# Altium schematic sheet принципиальная.schdoc
size 840 x 594 mm; Address1: Address1; Address2: Address2; Address3: Address3; Разраб.: Каленик; Обозначение документа: ГУИР.467849.001 Э3; Пров.: Порхун; Т.контр.: Порхун; Н.контр.: Лихачев; Утв.: Азаров; Общее количество листов: 1; Литера: Т; Наименование организации: БГУИР, гр. 850701; Наименование изделия 1: Электронная книга на; Нач. отд.: Реценз.; Rule: PcbType=ProtelPcb
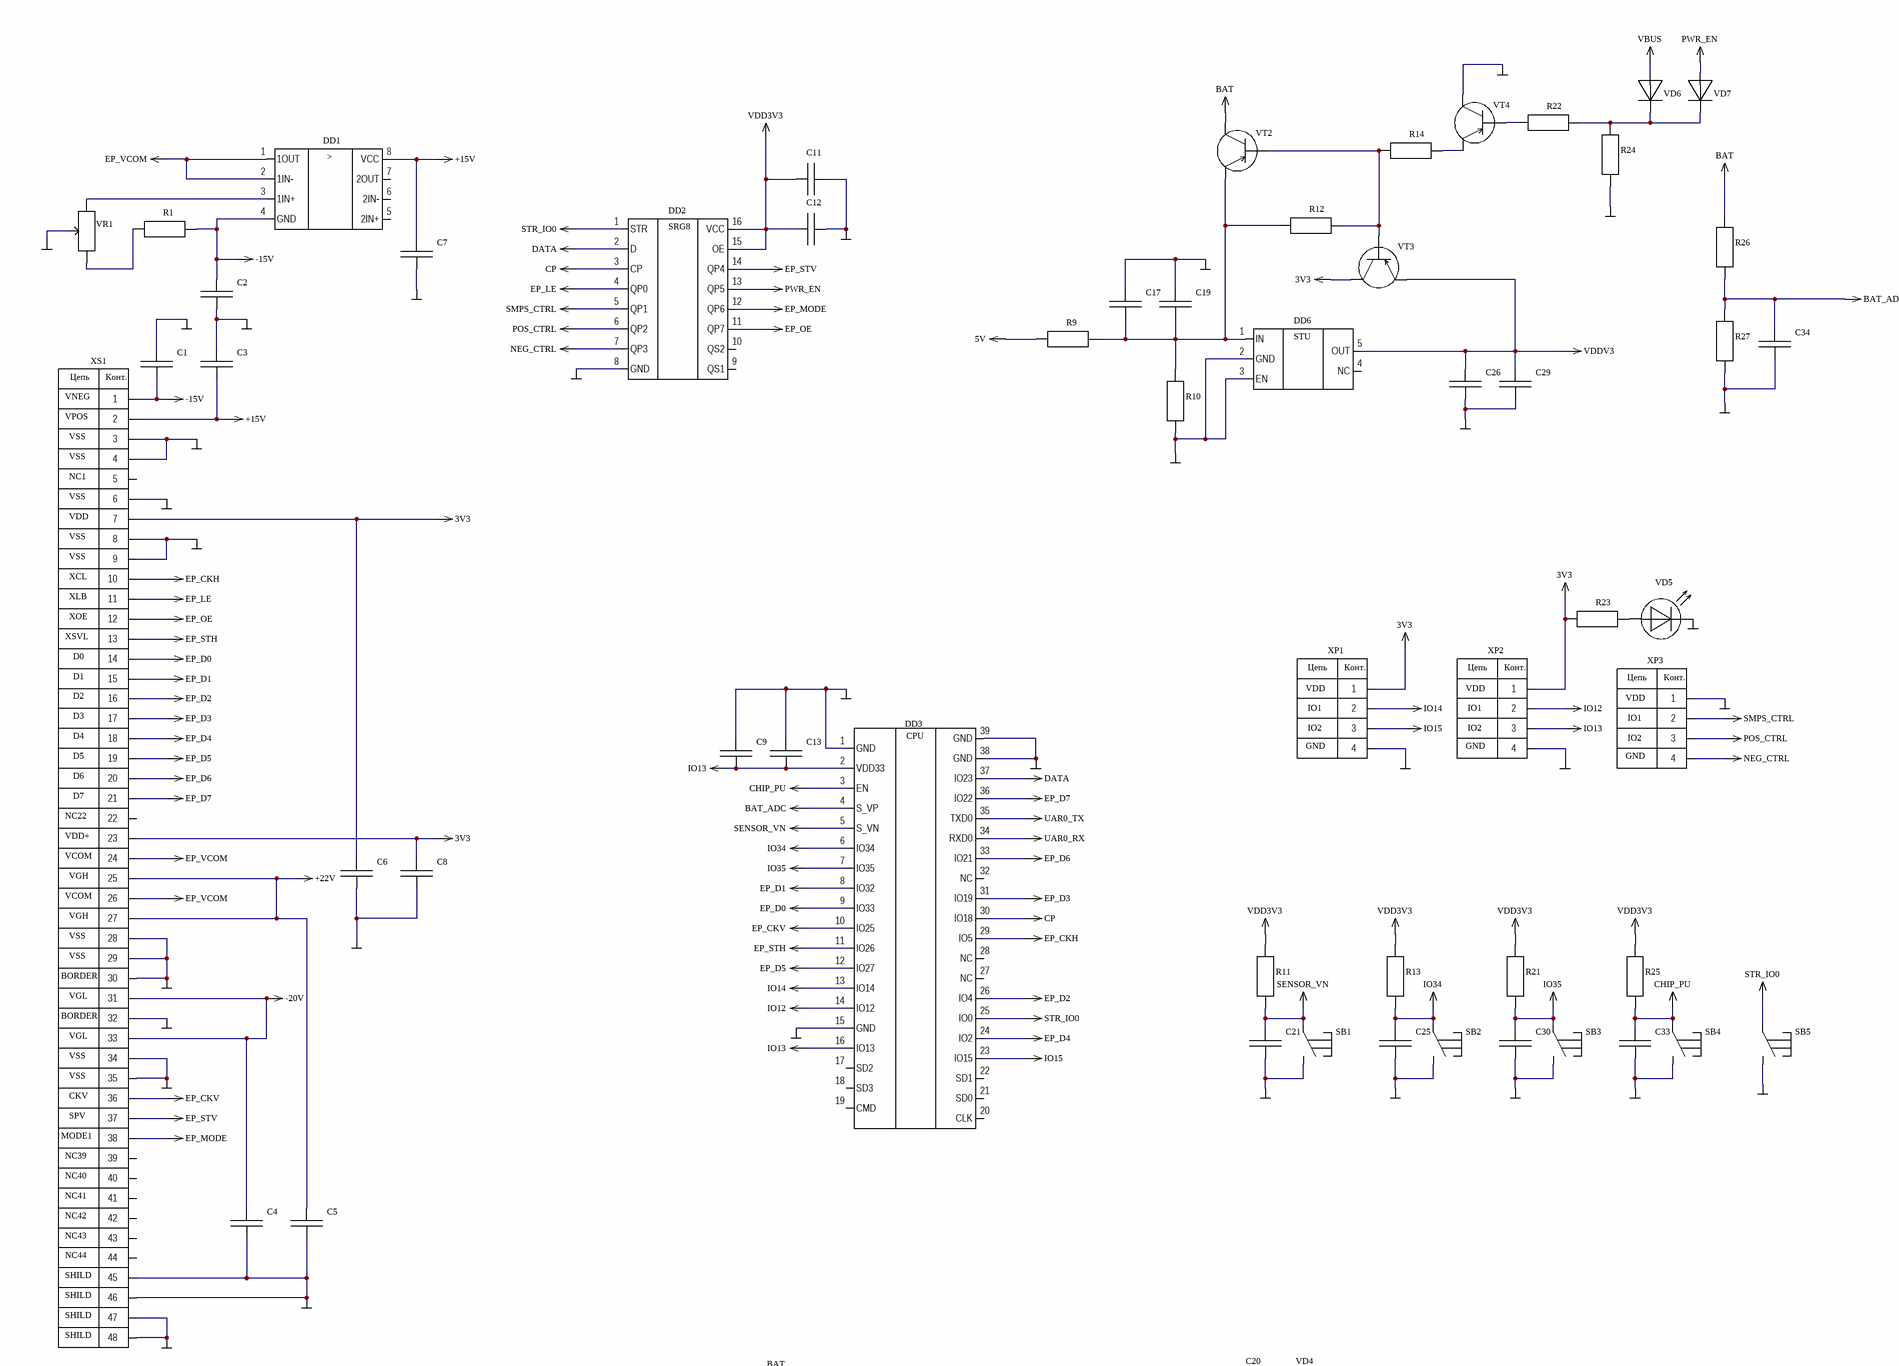
[diagram p0: принципиальная.schdoc, top left]
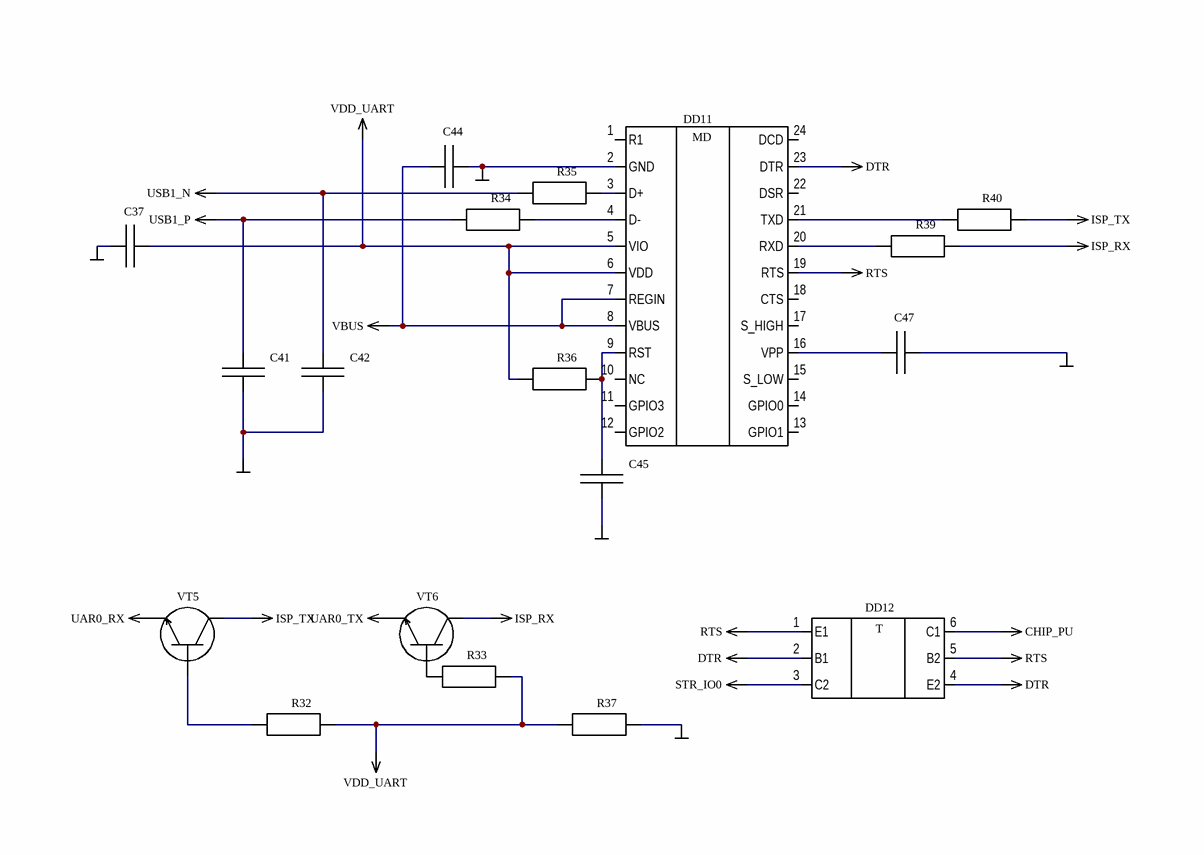
[diagram p1: принципиальная.schdoc, top right]
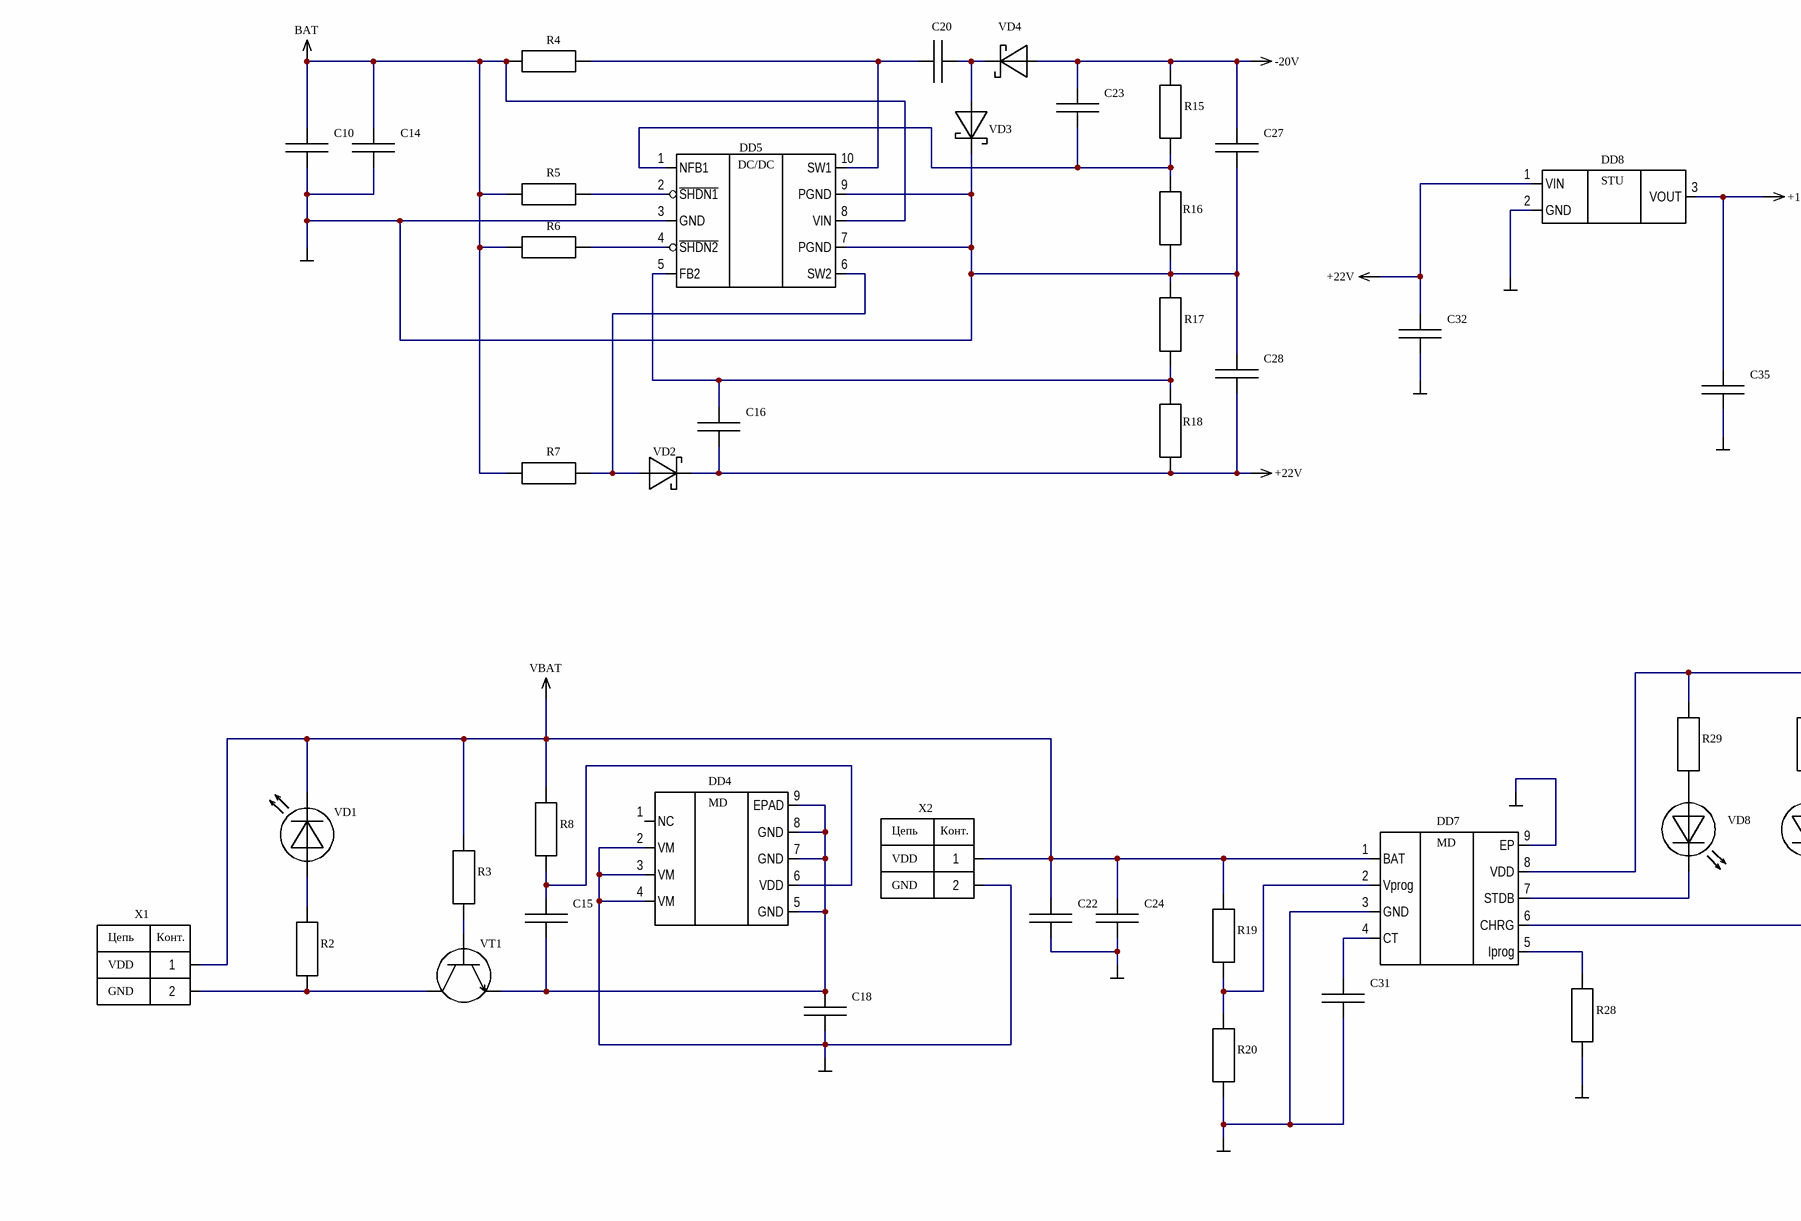
[diagram p2: принципиальная.schdoc, bottom left]
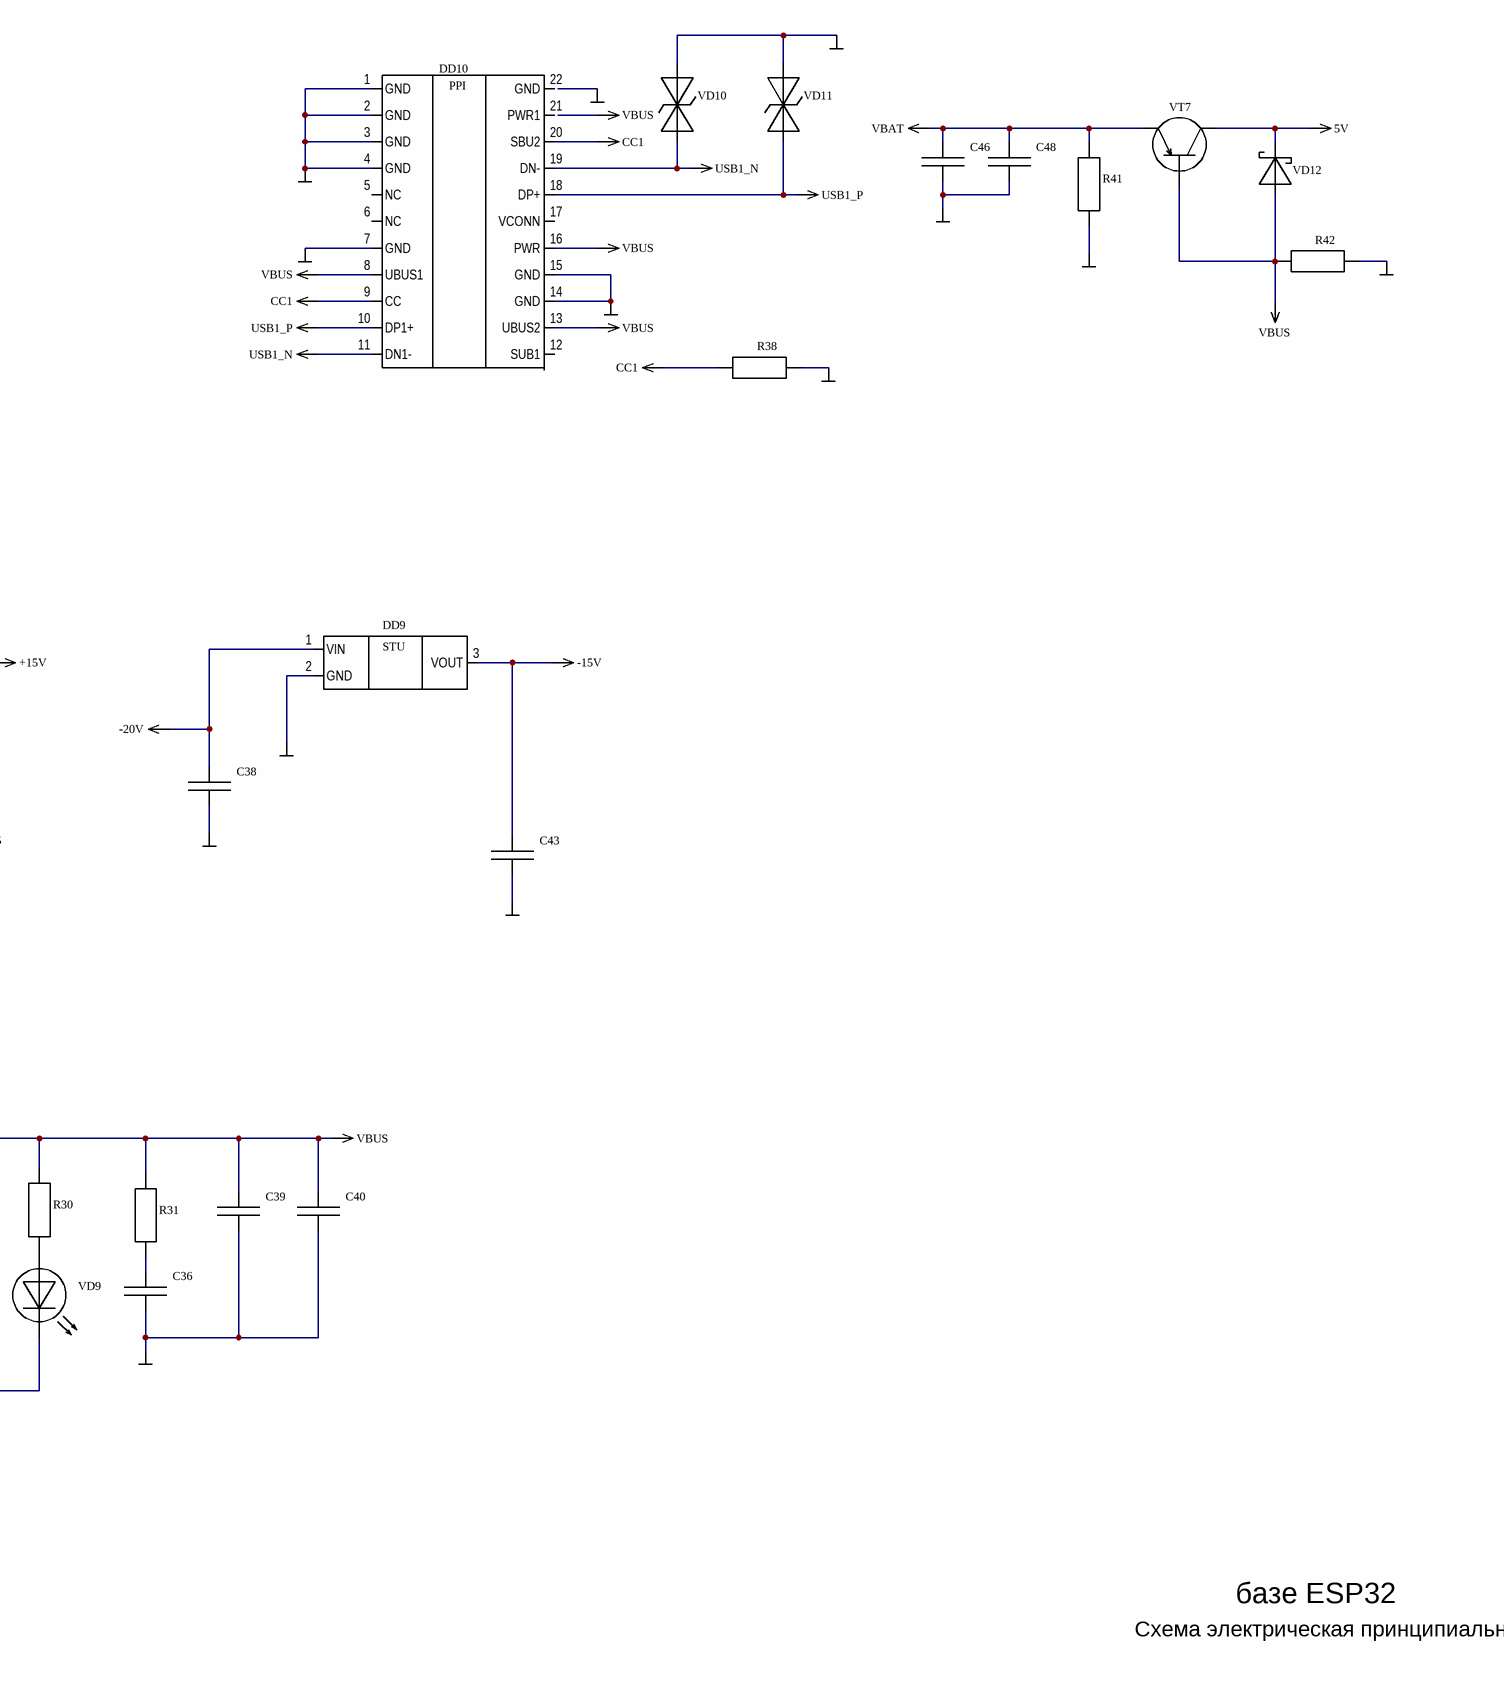
[diagram p3: принципиальная.schdoc, bottom right]

## Parts
C1  Capacitor  [CAP3216X125N]  (value not drawn)
C2  Capacitor  [CAP3216X125N]  (value not drawn)
C3  Capacitor  [CAP3216X125N]  (value not drawn)
C4  Capacitor  [CAP3216X125N]  (value not drawn)
C5  Capacitor  [CAP3216X125N]  (value not drawn)
C6  Capacitor  [CAP3216X125N]  (value not drawn)
C7  Capacitor  [CAP3216X125N]  (value not drawn)
C8  Capacitor  [CAP3216X125N]  (value not drawn)
C9  Capacitor  [CAP3216X125N]  (value not drawn)
C10  Capacitor  [CAP3216X125N]  (value not drawn)
C11  Capacitor  [CAP3216X125N]  (value not drawn)
C12  Capacitor  [CAP3216X125N]  (value not drawn)
C13  Capacitor  [CAP3216X125N]  (value not drawn)
C14  Capacitor  [CAP3216X125N]  (value not drawn)
C15  Capacitor  [CAP3216X125N]  (value not drawn)
C16  Capacitor  [CAP3216X125N]  (value not drawn)
C17  Capacitor  [CAP3216X125N]  (value not drawn)
C18  Capacitor  [CAP3216X125N]  (value not drawn)
C19  Capacitor  [CAP3216X125N]  (value not drawn)
C20  Capacitor  [CAP3216X125N]  (value not drawn)
C21  Capacitor  [CAP3216X125N]  (value not drawn)
C22  Capacitor  [CAP3216X125N]  (value not drawn)
C23  Capacitor  [CAP3216X125N]  (value not drawn)
C24  Capacitor  [CAP3216X125N]  (value not drawn)
C25  Capacitor  [CAP3216X125N]  (value not drawn)
C26  Capacitor  [CAP3216X125N]  (value not drawn)
C27  Capacitor  [CAP3216X125N]  (value not drawn)
C28  Capacitor  [CAP3216X125N]  (value not drawn)
C29  Capacitor  [CAP3216X125N]  (value not drawn)
C30  Capacitor  [CAP3216X125N]  (value not drawn)
C31  Capacitor  [CAP3216X125N]  (value not drawn)
C32  Capacitor  [CAP3216X125N]  (value not drawn)
C33  Capacitor  [CAP3216X125N]  (value not drawn)
C34  Capacitor  [CAP3216X125N]  (value not drawn)
C35  Capacitor  [CAP3216X125N]  (value not drawn)
C36  Capacitor  [CAP3216X125N]  (value not drawn)
C37  Capacitor  [CAP3216X125N]  (value not drawn)
C38  Capacitor  [CAP3216X125N]  (value not drawn)
C39  Capacitor  [CAP3216X125N]  (value not drawn)
C40  Capacitor  [CAP3216X125N]  (value not drawn)
C41  Capacitor  [CAP3216X125N]  (value not drawn)
C42  Capacitor  [CAP3216X125N]  (value not drawn)
C43  Capacitor  [CAP3216X125N]  (value not drawn)
C44  Capacitor  [CAP3216X125N]  (value not drawn)
C45  Capacitor  [CAP3216X125N]  (value not drawn)
C46  Capacitor  [CAP3216X125N]  (value not drawn)
C47  Capacitor  [CAP3216X125N]  (value not drawn)
C48  Capacitor  [CAP3216X125N]  (value not drawn)
DD1  LM358DR2G  [SOIC127P599X175-8N]  (value not drawn)
DD2  74HCT4094D  [SOIC127P1030X265-16N]  (value not drawn)
DD3  ESP32-WROVER-E  [XCVR_ESP32-WROVER]  (value not drawn)
DD4  IP3005A  [ESOP-8_L4.9-W3.9-P1.27-LS6.0-BL-EP]  (value not drawn)
DD5  LT1945  [MSOP-10_MS]  (value not drawn)
DD6  AP2112K  [SOT95P280X145-5N]  (value not drawn)
DD7  HX6610S  [ESOP-8_L4.9-W3.9-P1.27-LS6.0-BL-EP]  (value not drawn)
DD8  CJ78L15  [REG_MCP1702T-3302E/MB]  (value not drawn)
DD9  CJ78L15  [REG_MCP1702T-3302E/MB]  (value not drawn)
DD10  TYPE C  [QFN50P400X400X80-25N]  (value not drawn)
DD11  CP2014  [QFN50P400X400X80-25N]  (value not drawn)
DD12  UMH3N  [SOP65P210X100-6N]  (value not drawn)
R1  Resistor  [res0603]  (value not drawn)
R2  Resistor  [res0603]  (value not drawn)
R3  Resistor  [res0603]  (value not drawn)
R4  Resistor  [res0603]  (value not drawn)
R5  Resistor  [res0603]  (value not drawn)
R6  Resistor  [res0603]  (value not drawn)
R7  Resistor  [res0603]  (value not drawn)
R8  Resistor  [res0603]  (value not drawn)
R9  Resistor  [res0603]  (value not drawn)
R10  Resistor  [res0603]  (value not drawn)
R11  Resistor  [res0603]  (value not drawn)
R12  Resistor  [res0603]  (value not drawn)
R13  Resistor  [res0603]  (value not drawn)
R14  Resistor  [res0603]  (value not drawn)
R15  Resistor  [res0603]  (value not drawn)
R16  Resistor  [res0603]  (value not drawn)
R17  Resistor  [res0603]  (value not drawn)
R18  Resistor  [res0603]  (value not drawn)
R19  Resistor  [res0603]  (value not drawn)
R20  Resistor  [res0603]  (value not drawn)
R21  Resistor  [res0603]  (value not drawn)
R22  Resistor  [res0603]  (value not drawn)
R23  Resistor  [res0603]  (value not drawn)
R24  Resistor  [res0603]  (value not drawn)
R25  Resistor  [res0603]  (value not drawn)
R26  Resistor  [res0603]  (value not drawn)
R27  Resistor  [res0603]  (value not drawn)
R28  Resistor  [res0603]  (value not drawn)
R29  Resistor  [res0603]  (value not drawn)
R30  Resistor  [res0603]  (value not drawn)
R31  Resistor  [res0603]  (value not drawn)
R32  Resistor  [res0603]  (value not drawn)
R33  Resistor  [res0603]  (value not drawn)
R34  Resistor  [res0603]  (value not drawn)
R35  Resistor  [res0603]  (value not drawn)
R36  Resistor  [res0603]  (value not drawn)
R37  Resistor  [res0603]  (value not drawn)
R38  Resistor  [res0603]  (value not drawn)
R39  Resistor  [res0603]  (value not drawn)
R40  Resistor  [res0603]  (value not drawn)
R41  Resistor  [res0603]  (value not drawn)
R42  Resistor  [res0603]  (value not drawn)
SB1  button  [SW_147873-1]  (value not drawn)
SB2  button  [SW_147873-1]  (value not drawn)
SB3  button  [SW_147873-1]  (value not drawn)
SB4  button  [SW_147873-1]  (value not drawn)
SB5  button  [SW_147873-1]  (value not drawn)
VD1  LED diode  [BEADC0603X33N]  (value not drawn)
VD2  1N5819  [SOD3715X145N]  (value not drawn)
VD3  1N5819  [SOD3715X145N]  (value not drawn)
VD4  1N5819  [SOD3715X145N]  (value not drawn)
VD5  LED diode  [BEADC0603X33N]  (value not drawn)
VD6  Diod  [SODFL1608X70N]  (value not drawn)
VD7  Diod  [SODFL1608X70N]  (value not drawn)
VD8  LED diode  [BEADC0603X33N]  (value not drawn)
VD9  LED diode  [BEADC0603X33N]  (value not drawn)
VD10  ESD diode  [SOD523]  (value not drawn)
VD11  ESD diode  [SOD523]  (value not drawn)
VD12  1N5819  [SOD3715X145N]  (value not drawn)
VR1  TRIMPOT-SMD-3MM  [TRIMPOT-SMD-TC33X]  (value not drawn)
VT1  Transistor(npn)  [SOT23-3P96_237X112L42X44]  (value not drawn)
VT2  Transistor(pnp)  [SOT23-3P96_237X112L42X44]  (value not drawn)
VT3  Transistor(pnp)  [SOT23-3P96_237X112L42X44]  (value not drawn)
VT4  Transistor(pnp)  [SOT23-3P96_237X112L42X44]  (value not drawn)
VT5  Transistor(npn)  [SOT23-3P96_237X112L42X44]  (value not drawn)
VT6  Transistor(npn)  [SOT23-3P96_237X112L42X44]  (value not drawn)
VT7  Transistor(pnp)  [SOT23-3P96_237X112L42X44]  (value not drawn)
X1  2P  [2P]  (value not drawn)
X2  2P  [2P]  (value not drawn)
XP1  MOLEX P4  [MOLEX_15244441]  (value not drawn)
XP2  MOLEX P4  [MOLEX_15244441]  (value not drawn)
XP3  MOLEX P4  [MOLEX_15244441]  (value not drawn)
XS1  DVI  [GCT_FFC2B28-22-G_REVA]  (value not drawn)

## Nets
3V3: C6.1(A) C8.1(A) R23.1(A) VT3.2(B) XP1.1 XP2.1 XS1.7 XS1.23
5V: R9.1(A) VD12.2(B) VT7.2(B)
+15V: C3.2(A) C7.1(A) C35.1(A) DD1.8(VCC) DD8.3(VOUT) XS1.2
+22V: C5.1(A) C16.2(A) C28.2(A) C32.1(A) DD8.1(VIN) R18.1(A) VD2.2(B) XS1.25 XS1.27
-15V: C1.2(A) C2.1(A) C43.1(A) DD1.4(GND) DD9.3(VOUT) R1.2(B) XS1.1
-20V: C4.1(A) C23.1(A) C27.1(A) C38.1(A) DD9.1(VIN) R15.2(B) VD4.1(A) XS1.31 XS1.33
BAT: C10.1(A) C14.1(A) DD5.8(VIN) R4.1(A) R5.1(A) R6.1(A) R7.1(A) R26.2(B) VT2.2(B)
BAT_ADC: C34.1(A) DD3.4(S_VP) R26.1(A) R27.2(B)
CC1: DD10.9(CC) DD10.20(SBU2) R38.1(A)
CHIP_PU: C33.2(A) DD3.3(EN) DD12.6(C1) R25.1(A) SB4.1
CP: DD2.3(CP) DD3.30(IO18)
DATA: DD2.2(D) DD3.37(IO23)
DTR: DD11.23(DTR) DD12.2(B1) DD12.4(E2)
EP_CKH: DD3.29(IO5) XS1.10
EP_CKV: DD3.10(IO25) XS1.36
EP_D0: DD3.9(IO33) XS1.14
EP_D1: DD3.8(IO32) XS1.15
EP_D2: DD3.26(IO4) XS1.16
EP_D3: DD3.31(IO19) XS1.17
EP_D4: DD3.24(IO2) XS1.18
EP_D5: DD3.12(IO27) XS1.19
EP_D6: DD3.33(IO21) XS1.20
EP_D7: DD3.36(IO22) XS1.21
EP_LE: DD2.4(QP0) XS1.11
EP_MODE: DD2.12(QP6) XS1.38
EP_OE: DD2.11(QP7) XS1.12
EP_STH: DD3.11(IO26) XS1.13
EP_STV: DD2.14(QP4) XS1.37
EP_VCOM: DD1.1(1OUT) DD1.2(1IN-) XS1.24 XS1.26
GND: C1.1(A) C2.2(A) C3.1(A) C4.2(A) C5.2(A) C6.2(A) C7.2(A) C8.2(A) C9.1(A) C10.2(A) C11.1(A) C12.1(A) C13.1(A) C14.2(A) C17.1(A) C18.2(A) C19.1(A) C21.1(A) C22.2(A) C24.2(A) C25.1(A) C26.2(A) C27.2(A) C28.1(A) C29.2(A) C30.1(A) C31.2(A) C32.2(A) C33.1(A) C34.2(A) C35.2(A) C36.2(A) C37.2(A) C38.2(A) C39.2(A) C40.2(A) C41.2(A) C42.2(A) C43.2(A) C44.1(A) C45.2(A) C46.2(A) C47.1(A) C48.2(A) DD2.8(GND) DD3.1(GND) DD3.15(GND) DD3.38(GND) DD3.39(GND) DD4.2(VM) DD4.3(VM) DD4.4(VM) DD5.3(GND) DD5.7(PGND) DD5.9(PGND) DD6.2(GND) DD6.3(EN) DD7.3(GND) DD7.9(EP) DD8.2(GND) DD9.2(GND) DD10.1(GND) DD10.2(GND) DD10.3(GND) DD10.4(GND) DD10.7(GND) DD10.14(GND) DD10.15(GND) DD11.2(GND) R10.1(A) R16.1(A) R17.2(B) R20.1(A) R24.1(A) R27.1(A) R28.1(A) R37.2(B) R38.2(B) R41.1(A) R42.2(B) SB1.2 SB2.2 SB3.2 SB4.2 SB5.2 VD3.2(B) VD5.2(B) VD10.2(B) VD11.2(B) VR1.3(C) VT4.2(B) X2.2 XP1.4 XP2.4 XP3.1 XS1.3 XS1.4 XS1.6 XS1.8 XS1.9 XS1.28 XS1.29 XS1.30 XS1.32 XS1.34 XS1.35 XS1.45 XS1.46 XS1.47 XS1.48
IO12: DD3.14(IO12) XP2.2
IO13: C9.2(A) C13.2(A) DD3.2(VDD33) DD3.16(IO13) XP2.3
IO14: DD3.13(IO14) XP1.2
IO15: DD3.23(IO15) XP1.3
IO34: C25.2(A) DD3.6(IO34) R13.1(A) SB2.1
IO35: C30.2(A) DD3.7(IO35) R21.1(A) SB3.1
ISP_RX: R39.2(B) VT6.2(B)
ISP_TX: R40.2(B) VT5.2(B)
NEG_CTRL: DD2.7(QP3) XP3.4
POS_CTRL: DD2.6(QP2) XP3.3
PWR_EN: DD2.13(QP5) VD7.1
RTS: DD11.19(RTS) DD12.1(E1) DD12.5(B2)
SENSOR_VN: C21.2(A) DD3.5(S_VN) R11.1(A) SB1.1
SMPS_CTRL: DD2.5(QP1) XP3.2
STR_IO0: DD2.1(STR) DD3.25(IO0) DD12.3(C2) SB5.1
UAR0_RX: DD3.34(RXD0) VT5.1(A)
UAR0_TX: DD3.35(TXD0) VT6.1(A)
USB1_N: C42.1(A) DD10.11(DN1-) DD10.19(DN-) R35.1(A) VD10.1(A)
USB1_P: C41.1(A) DD10.10(DP1+) DD10.18(DP+) R34.1(A) VD11.1(A)
VBAT: C22.1(A) C24.1(A) C46.1(A) C48.1(A) DD7.1(BAT) R3.2(B) R8.2(B) R19.2(B) R41.2(B) VD1.2(B) VT7.1(A) X1.1 X2.1
VBUS: C39.1(A) C40.1(A) C44.2(A) DD7.8(VDD) DD10.8(UBUS1) DD10.13(UBUS2) DD10.16(PWR) DD11.7(REGIN) DD11.8(VBUS) R29.2(B) R30.2(B) R31.2(B) R42.1(A) VD6.1 VD12.1(A) VT7.3(C)
VDD3V3: C11.2(A) C12.2(A) DD2.15(OE) DD2.16(VCC) R11.2(B) R13.2(B) R21.2(B) R25.2(B)
VDD_UART: C37.1(A) DD11.5(VIO) DD11.6(VDD) R32.2(B) R33.2(B) R36.1(A) R37.1(A)
VDDV3: C26.1(A) C29.1(A) DD6.5(OUT) VT3.1(A)
NetC15_1: C15.1(A) DD4.6(VDD) R8.1(A)
NetC15_2: C15.2(A) C18.1(A) DD4.5(GND) DD4.7(GND) DD4.8(GND) DD4.9(EPAD) VT1.1(A)
NetC16_1: C16.1(A) DD5.5(FB2) R17.1(A) R18.2(B)
NetC17_2: C17.2(A) C19.2(A) DD6.1(IN) R9.2(B) R10.2(B) R12.1(A) VT2.1(A)
NetC20_1: C20.1(A) VD3.1(A) VD4.2(B)
NetC20_2: C20.2(A) DD5.10(SW1) R4.2(B)
NetC23_2: C23.2(A) DD5.1(NFB1) R15.1(A) R16.2(B)
NetC31_1: C31.1(A) DD7.4(CT)
NetC36_1: C36.1(A) R31.1(A)
NetC45_1: C45.1(A) DD11.9(RST) R36.2(B)
NetC47_2: C47.2(A) DD11.16(VPP)
NetDD1_3: DD1.3(1IN+) VR1.1(A)
NetDD5_2: DD5.2(~{SHDN1}) R5.2(B)
NetDD5_4: DD5.4(~{SHDN2}) R6.2(B)
NetDD5_6: DD5.6(SW2) R7.2(B) VD2.1(A)
NetDD7_2: DD7.2(Vprog) R19.1(A) R20.2(B)
NetDD7_5: DD7.5(Iprog) R28.2(B)
NetDD7_6: DD7.6(CHRG) VD9.2(B)
NetDD7_7: DD7.7(STDB) VD8.2(B)
NetDD11_3: DD11.3(D+) R35.2(B)
NetDD11_4: DD11.4(D-) R34.2(B)
NetDD11_20: DD11.20(RXD) R39.1(A)
NetDD11_21: DD11.21(TXD) R40.1(A)
NetR1_1: R1.1(A) VR1.2(B)
NetR2_1: R2.1(A) VT1.2(B) X1.2
NetR2_2: R2.2(B) VD1.1(A)
NetR3_1: R3.1(A) VT1.3(C)
NetR12_2: R12.2(B) R14.1(A) VT2.3(C) VT3.3(C)
NetR14_2: R14.2(B) VT4.1(A)
NetR22_1: R22.1(A) VT4.3(C)
NetR22_2: R22.2(B) R24.2(B) VD6.2 VD7.2
NetR23_2: R23.2(B) VD5.1(A)
NetR29_1: R29.1(A) VD8.1(A)
NetR30_1: R30.1(A) VD9.1(A)
NetR32_1: R32.1(A) VT5.3(C)
NetR33_1: R33.1(A) VT6.3(C)

Not connected (* = marked no-connect by the designer): DD1 5(2IN+) 6(2IN-) 7(2OUT); DD2 9(QS1) 10(QS2); DD3 17(SD2) 18(SD3) 19(CMD) 20(CLK) 21(SD0) 22(SD1) 27(NC) 28(NC) 32(NC); DD4 1(NC); DD6 4(NC); DD10 5(NC) 6(NC) 12(SUB1) 17(VCONN) 21(PWR1) 22(GND); DD11 1(R1) 10(NC) 11(GPIO3) 12(GPIO2) 13(GPIO1) 14(GPIO0) 15(S_LOW) 17(S_HIGH) 18(CTS) 22(DSR) 24(DCD); XS1 5 22 39 40 41 42 43 44

## Notes on the sheet
- Схема электрическая принципиальная
- базе ESP32
- Перв. примен.
- Справ. №
- Подп. и дата
- Инв. № дубл.
- Взам. инв. №
- Разраб.
- Изм.
- Лист
- № докум.
- Подп.
- Дата
- Лит.
- Масса
- Масштаб
- Пров.
- Т.контр.
- Листов
- Инв. № подл.
- Утв.
- Н.контр.
- Копировал
- Формат А1
- (in symbol 2P) Цепь; Конт.; VDD; GND
- (in symbol 74HCT4094D) SRG8
- (in symbol AP2112K) STU
- (in symbol CJ78L15) STU
- (in symbol CP2014) MD
- (in symbol DVI) Цепь; Конт.; VNEG; VPOS; VSS; NC1; VDD; XCL; XLB; XOE; XSVL; D0; D1; D2; D3; D4; D5; D6; D7; NC22; VDD+; VCOM; VGH; BORDER; VGL; CKV; SPV; MODE1; NC39; NC40; NC41; NC42; NC43; NC44; SHILD
- (in symbol ESP32-WROVER-E) CPU
- (in symbol HX6610S) MD
- (in symbol IP3005A) MD
- (in symbol LM358DR2G) >
- (in symbol LT1945) DC/DC
- (in symbol MOLEX P4) Цепь; Конт.; VDD; IO1; IO2; GND
- (in symbol TYPE C) PPI
- (in symbol UMH3N) T